# EAGLE schematic 4hp_right_angle (EAGLE 6.6.0)
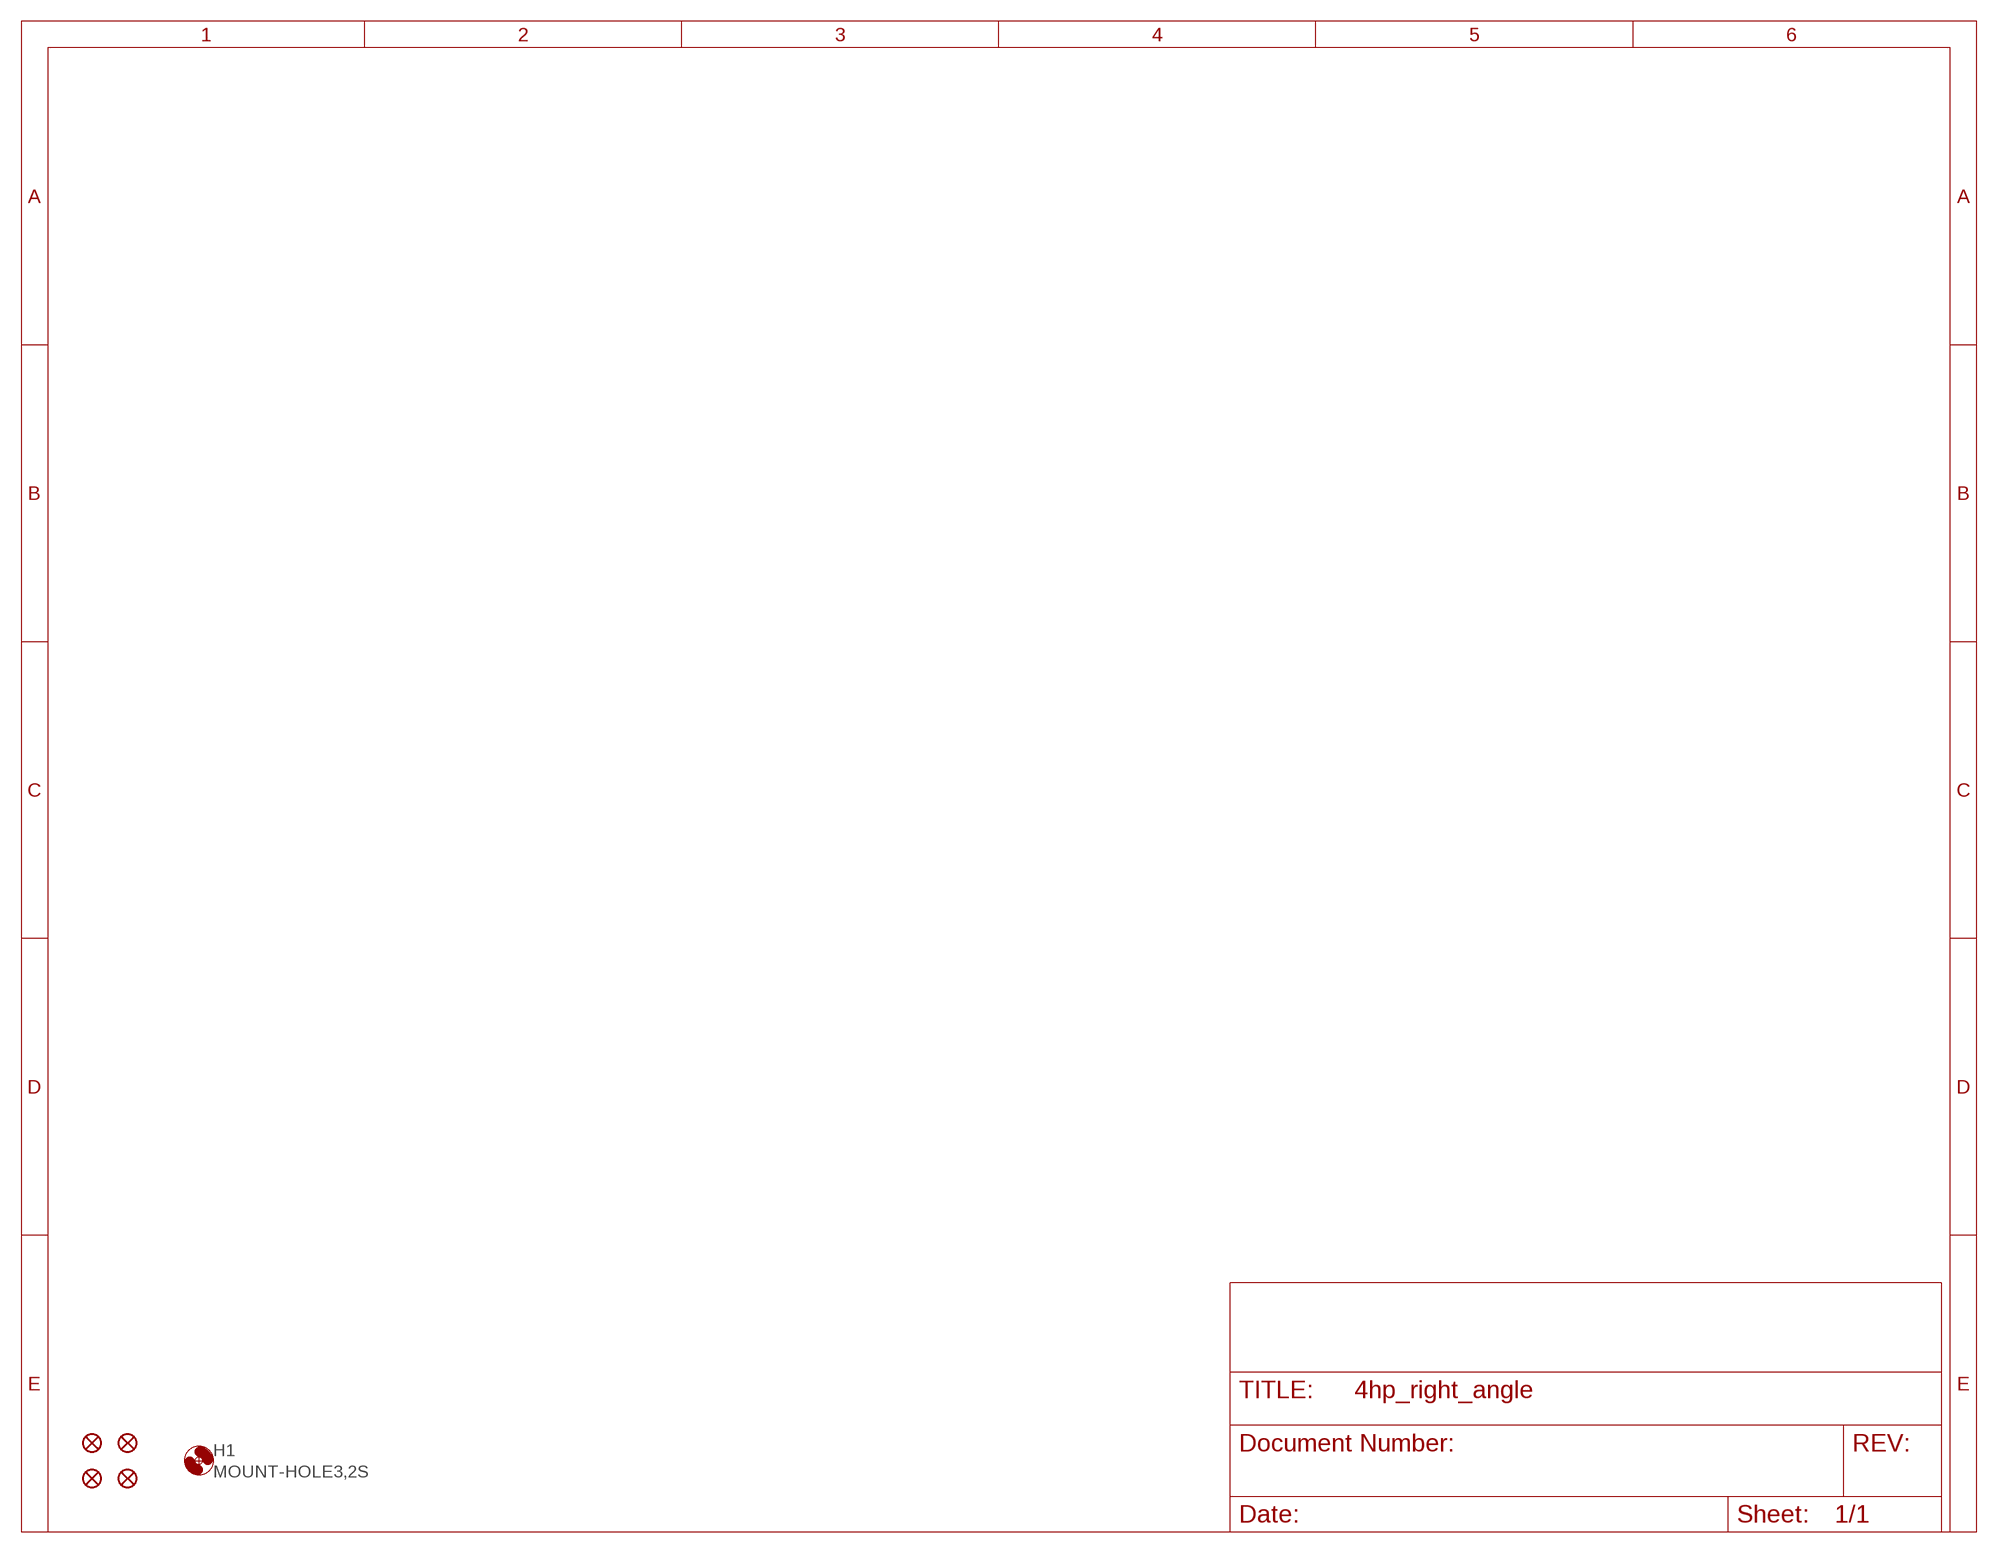
[diagram p0: schematic, sheet 1]

## Parts
FID1  FIDUCIALUFIDUCIAL  [MICRO-FIDUCIAL]
FID2  FIDUCIALUFIDUCIAL  [MICRO-FIDUCIAL]
FID3  FIDUCIALUFIDUCIAL  [MICRO-FIDUCIAL]
FID4  FIDUCIALUFIDUCIAL  [MICRO-FIDUCIAL]
H1  MOUNT-HOLE3,2S  [3,2,SMALL]

## Library data of the parts
FID1-FID4 = TSOC-ESP8266-BASE:FIDUCIAL: Fiducial Alignment Points Various fiducial points for machine vision alignment.
H1 = oXo_Hardware:MOUNT-HOLE: MOUNTING HOLE with drill center marker